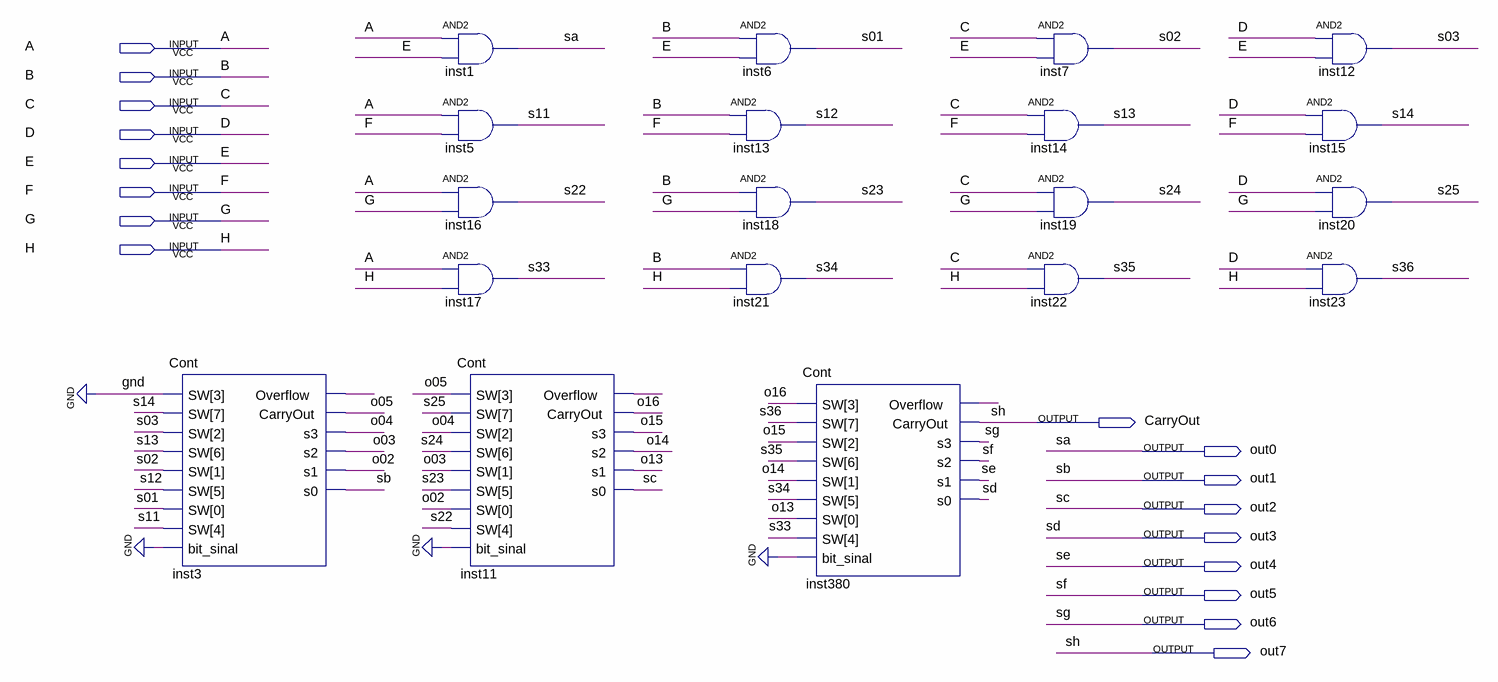
[diagram p0: schematic sheet]
// Quartus schematic multiplicador.bdf as structural Verilog: 19 symbols, 17 pins
module multiplicador (
  input  A,
  input  B,
  input  C,
  input  D,
  input  E,
  input  F,
  input  G,
  input  H,
  output CarryOut,
  output out0,
  output out1,
  output out2,
  output out3,
  output out4,
  output out5,
  output out6,
  output out7
);

  wire inst3_overflow, inst11_overflow, inst380_overflow, o02, o03, o04, o05, o13, o14, o15, o16, s01, s02,
       s03, s11, s12, s13, s14, s22, s23, s24, s25, s33, s34, s35, s36;

  Cont inst3 (
    .SW({s14, s13, s12, s11, 1'b0, s03, s02, s01}), .bit_sinal(1'b0), .Overflow(inst3_overflow),
    .CarryOut(o05), .s3(o04), .s2(o03), .s1(o02), .s0(out1));
  and inst1 (out0, A, E);
  and inst5 (s11, A, F);
  and inst16 (s22, A, G);
  and inst17 (s33, A, H);
  Cont inst11 (
    .SW({s25, s24, s23, s22, o05, o04, o03, o02}), .bit_sinal(1'b0), .Overflow(inst11_overflow),
    .CarryOut(o16), .s3(o15), .s2(o14), .s1(o13), .s0(out2));
  and inst13 (s12, B, F);
  and inst21 (s34, B, H);
  and inst6 (s01, B, E);
  and inst18 (s23, B, G);
  Cont inst380 (
    .SW({s36, s35, s34, s33, o16, o15, o14, o13}), .bit_sinal(1'b0), .Overflow(inst380_overflow),
    .CarryOut(CarryOut), .s3(out6), .s2(out5), .s1(out4), .s0(out3));
  and inst7 (s02, C, E);
  and inst14 (s13, C, F);
  and inst19 (s24, C, G);
  and inst22 (s35, C, H);
  and inst12 (s03, D, E);
  and inst15 (s14, D, F);
  and inst20 (s25, D, G);
  and inst23 (s36, D, H);

  assign out7 = CarryOut;

  // Other names for the same wires on the sheet: sa = out0; sb = out1; sc = out2; sd = out3; se = out4; sf = out5;
  //   sg = out6; sh = CarryOut
endmodule
